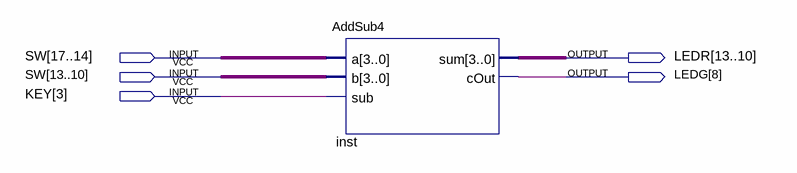
[diagram p0: schematic sheet]
// Quartus schematic AdderDemo.bdf as structural Verilog: 1 symbols, 5 pins
module AdderDemo (
  input  [17:10] SW,
  input  [3:3] KEY,
  output [13:10] LEDR,
  output [8:8] LEDG
);

  AddSub4 inst (.a(SW[17:14]), .b(SW[13:10]), .sub(KEY[3]), .sum(LEDR), .cOut(LEDG[8]));
endmodule
